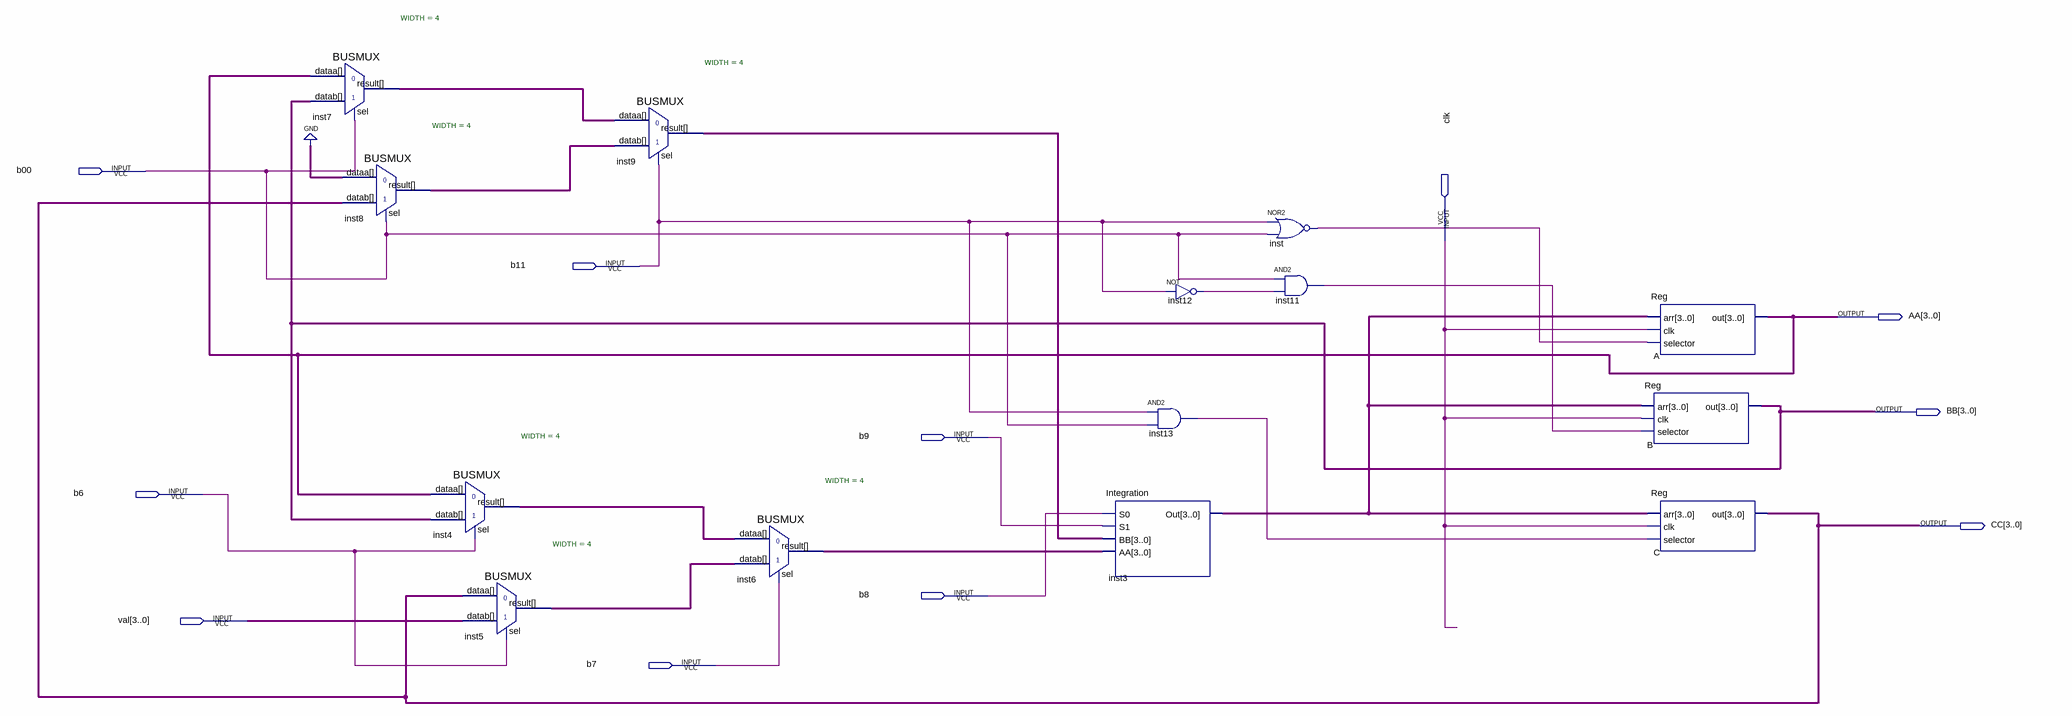
[diagram p0: schematic sheet]
// Quartus schematic decoding.bdf as structural Verilog: 14 symbols, 11 pins
module decoding (
  input  b00,
  input  clk,
  input  b11,
  input  b9,
  input  b6,
  input  b8,
  input  [3:0] val,
  input  b7,
  output [3:0] AA,
  output [3:0] BB,
  output [3:0] CC
);

  wire inst11_out, inst12_out, inst13_out, inst_out;
  wire [3:0] inst3_out, inst4_result, inst5_result, inst6_result, inst7_result, inst8_result, inst9_result;

  BUSMUX #(.WIDTH(4)) inst7 (.datab(BB), .sel(b00), .dataa(AA), .result(inst7_result));
  BUSMUX #(.WIDTH(4)) inst8 (.datab(CC), .sel(b00), .dataa(4'b0000), .result(inst8_result));
  BUSMUX #(.WIDTH(4)) inst4 (.datab(BB), .sel(b6), .dataa(AA), .result(inst4_result));
  BUSMUX #(.WIDTH(4)) inst5 (.datab(val), .sel(b6), .dataa(CC), .result(inst5_result));
  BUSMUX #(.WIDTH(4)) inst9 (.datab(inst8_result), .sel(b11), .dataa(inst7_result), .result(inst9_result));
  BUSMUX #(.WIDTH(4)) inst6 (.datab(inst5_result), .sel(b7), .dataa(inst4_result), .result(inst6_result));
  Integration inst3 (.S0(b8), .S1(b9), .BB(inst9_result), .AA(inst6_result), .Out(inst3_out));
  not inst12 (inst12_out, b11);
  and inst13 (inst13_out, b11, b00);
  nor inst (inst_out, b11, b00);
  and inst11 (inst11_out, b00, inst12_out);
  Reg A (.arr(inst3_out), .clk(clk), .selector(inst_out), .out(AA));
  Reg B (.arr(inst3_out), .clk(clk), .selector(inst11_out), .out(BB));
  Reg C (.arr(inst3_out), .clk(clk), .selector(inst13_out), .out(CC));
endmodule
